# EAGLE board Proj_v27 (EAGLE 9.6.0)
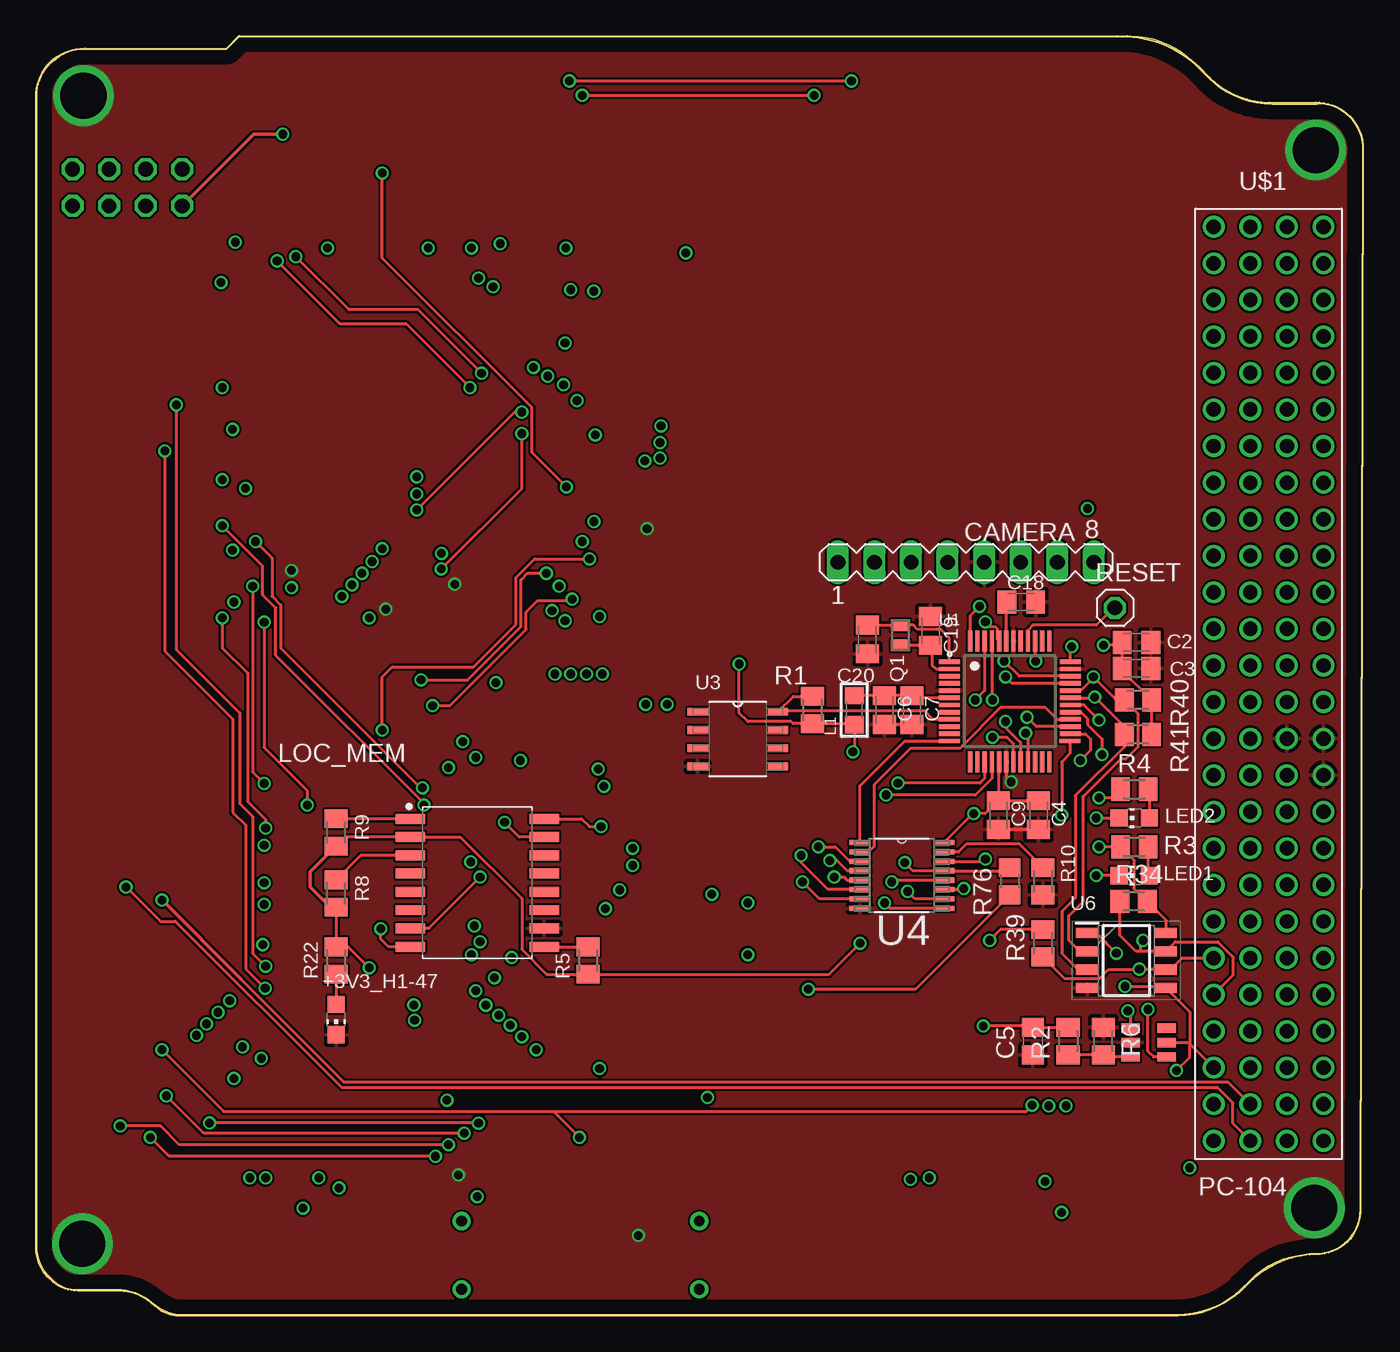
[diagram p7: board, top side]
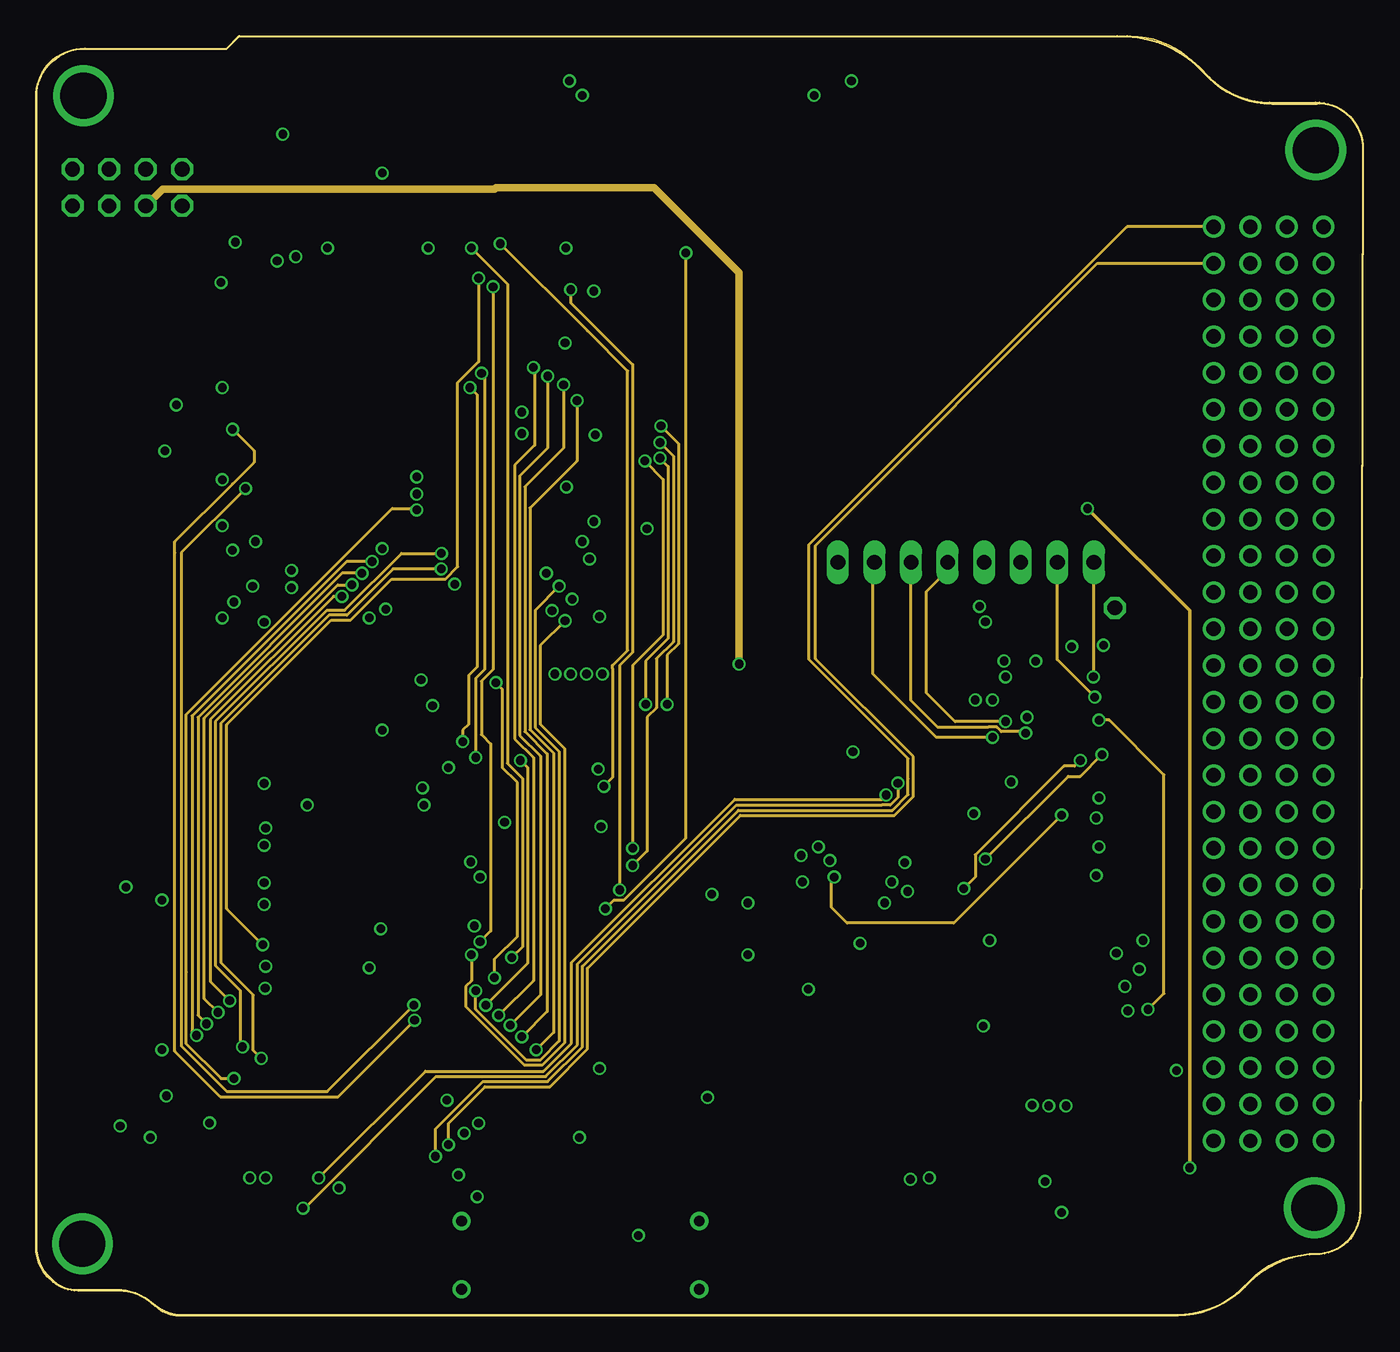
[diagram p8: board, inner layer Route]
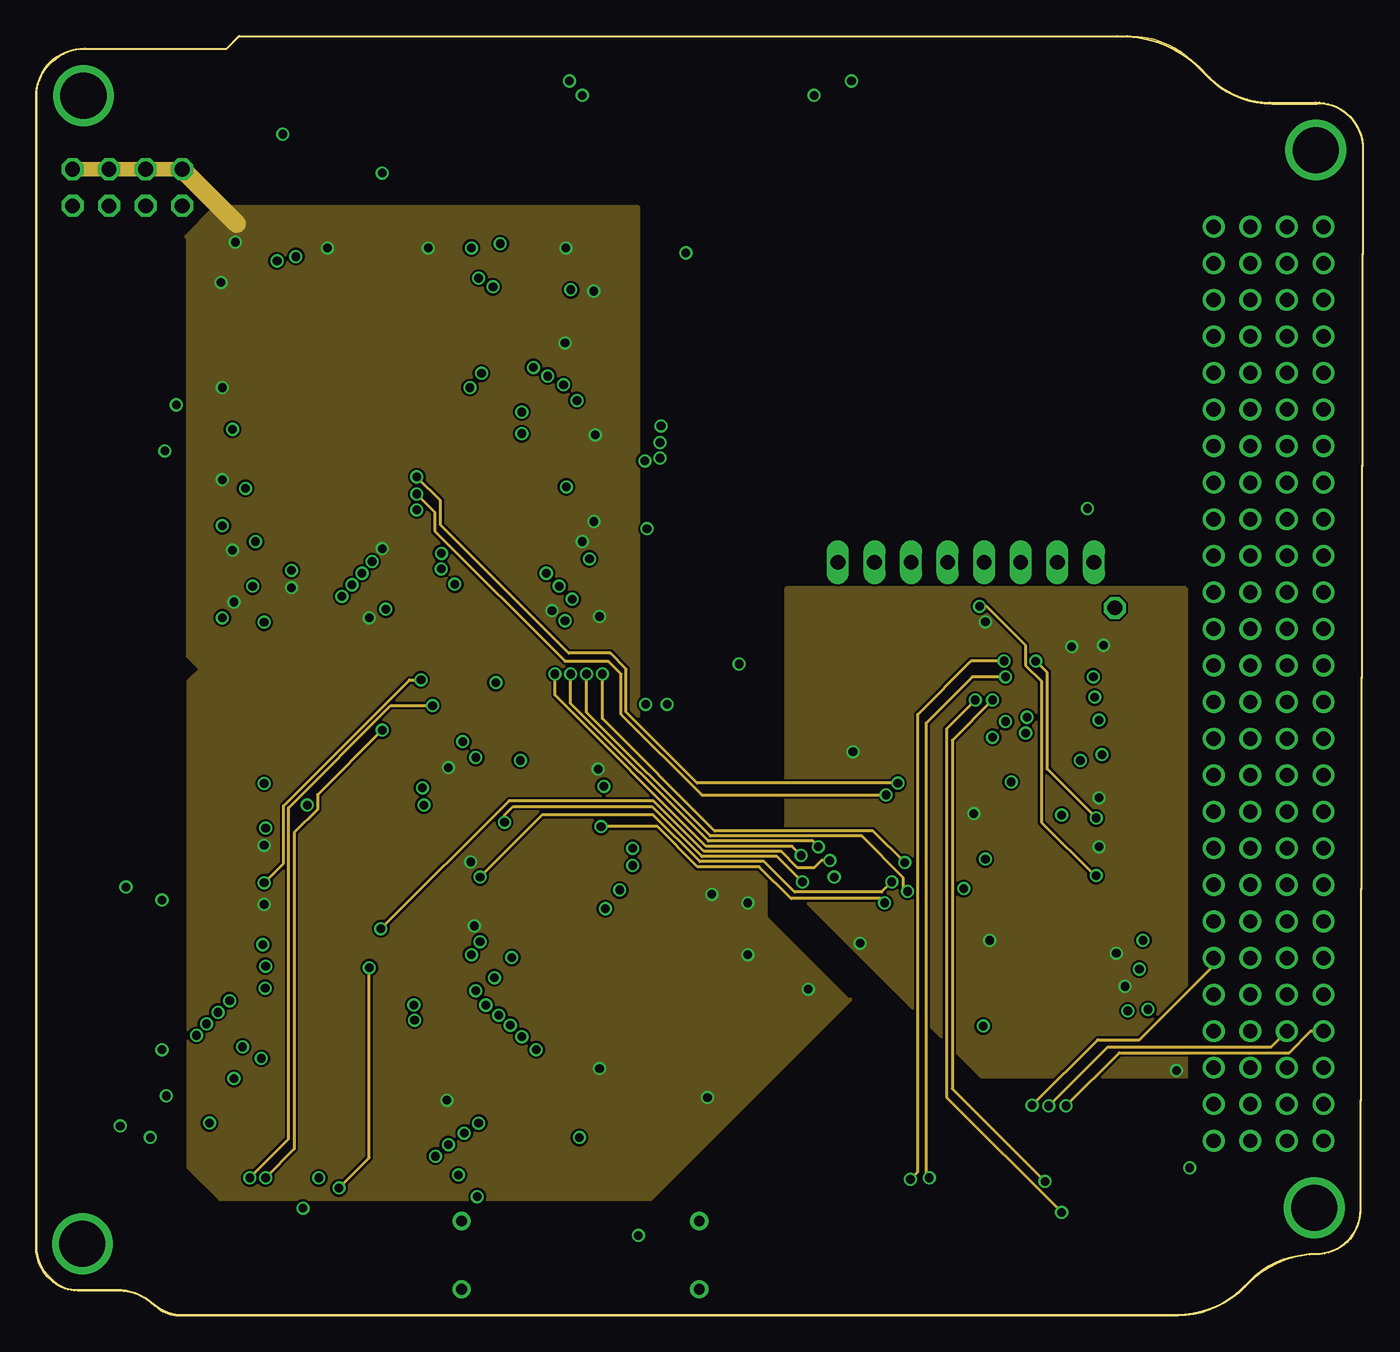
[diagram p9: board, inner layer Supply]
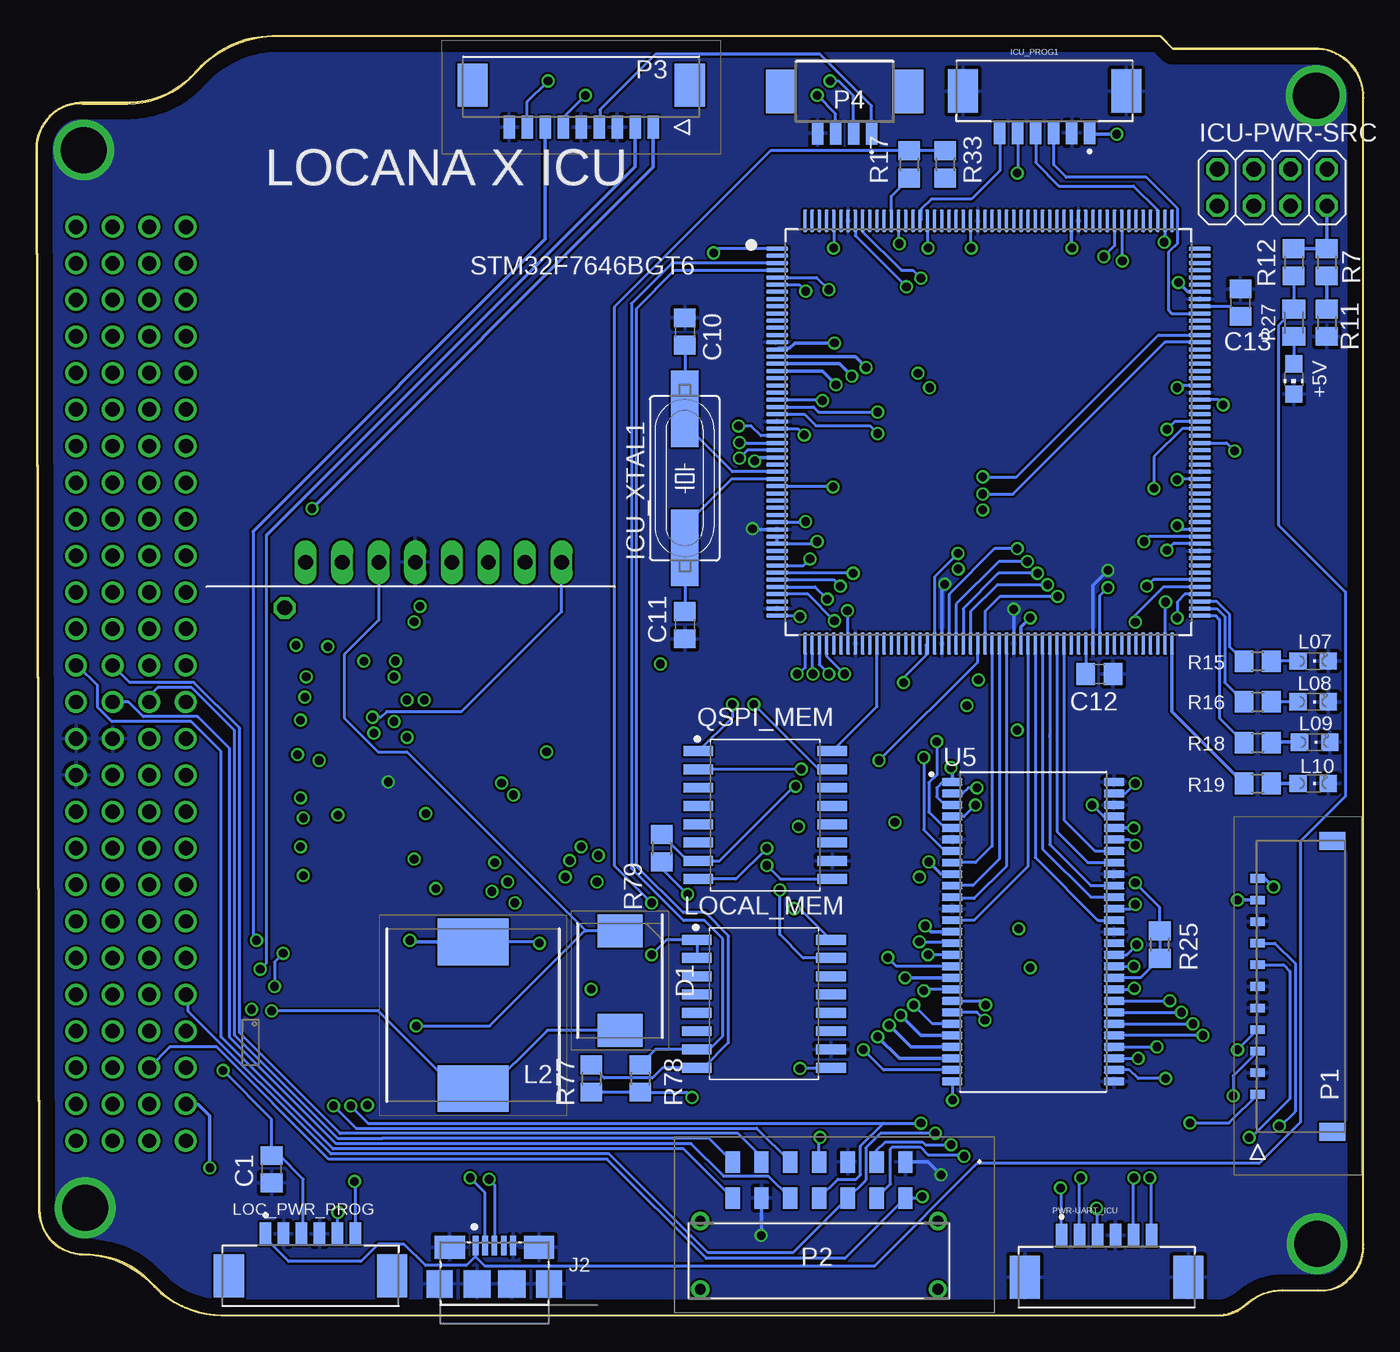
[diagram p10: board, bottom side, seen from below]

Size 92.22 x 88.9 mm. Coordinates in mm from the lower left corner, seen from the top.
Outline: 89.1,84.2 arc-90 92.22,81.05 92.02,7.52 arc-90 89,4.28 88.71,4.28 arc45 84.38,2.48 83.69,1.8 arc-45 79.36,0 9.88,0 arc-40 8.51,0.5 8.37,0.63 arc45 5.71,1.73 3.2,1.73 arc-90 0.05,4.83 0.05,84.83 arc-90 3.17,88 13.22,88 14.1,88.87 76.06,88.87 arc-45 80.39,87.08 81.5,85.97 arc45 85.84,84.18 89.02,84.18
Outline: 0,4.93 0,84.61 arc-90 3.41,88.03 13.25,88.03 14.12,88.9 75.11,88.9 arc-45 80.81,86.72 81.52,86.01 arc45 85.7,84.28 88.88,84.28 arc-90 92.17,81.13 92,7.66 arc-45 91.1,5.13 arc-35 89.21,4.28 89.05,4.28 arc45 84.27,2.3 83.98,2.01 arc-45 79.2,0.03 10.28,0.03 arc-41 8.04,0.87 arc41 5.62,1.78 3.15,1.78 arc-45 1.18,2.34 0.82,2.71 arc-45 0,4.93
Copper layers (1+2*15+16): Top 0.035mm / dielectric 1.5mm / Route 0.035mm / dielectric 0.15mm / Supply 0.035mm / dielectric 0.2mm / GND 0.035mm
Design rules "default *": minimum track width 6mil, minimum drill 0.6mm, track to track 6mil, track to pad 6mil, pad to pad 6mil, via to via 6mil, smd to smd 6mil, copper to edge 40mil, drill to drill 6mil, minimum pad ring 10mil, minimum via ring 6mil, stop-mask expansion 4mil, vias tented up to drill 0mil, thermal gap 10mil
Net classes: 0 default: width 0.203 mm; 1 GND: width 0.254 mm

## Footprints (pad centres in the part's own frame; a part is rotated, then mirrored left to right if it is on the bottom)
CHIP-LED0805 = smd 1.2 x 1.2: A 0,-1.05; C 0,1.05
C0805 = smd 1.3 x 1.5: 1 -0.95,0; 2 0.95,0
C0805K = smd 1.3 x 1.6: 1 -1,0; 2 1,0
MA08-1 = drill 1.016 long: 1 -8.89,0; 2 -6.35,0; 3 -3.81,0; 4 -1.27,0; 5 1.27,0; 6 3.81,0; 7 6.35,0; 8 8.89,0
DIOM7959X262N = smd 2.3 x 3.15: 1 -3.45,0; 2 3.45,0
2X04 = drill 1.016 octagon: 1 -3.81,-1.27; 2 -3.81,1.27; 3 -1.27,-1.27; 4 -1.27,1.27; 5 1.27,-1.27; 6 1.27,1.27; 7 3.81,-1.27; 8 3.81,1.27
MOLEX_0532610671 = smd 0.8 x 1.6: 1 -3.125,0; 2 -1.875,0; 3 -0.625,0; 4 0.625,0; 5 1.875,0; 6 3.125,0 | smd 2.1 x 3: S1 -5.675,-2.9; S2 5.675,-2.9
HC49UP = smd 5.334 x 1.93: 1 -4.826,0; 2 4.826,0
AMPHENOL_10118192-0001LF = smd 0.4 x 1.35: 1 -1.3,0; 2 -0.65,0; 3 0,0; 4 0.65,0; 5 1.3,0 | smd 2.1 x 1.6: SH1 -3.1,-0.125; SH2 3.1,-0.125 | smd 1.8 x 1.9: SH3 -3.8,-2.675; SH6 3.8,-2.675 | smd 1.9 x 1.9: SH4 -1.2,-2.675; SH5 1.2,-2.675
L0805 = smd 1.2 x 1.3: 1 -1.016,0; 2 1.016,0
INDPM120120X1000N = smd 3.25 x 4.95: 1 -5.1,0; 2 5.1,0
CHIPLED_0805 = smd 1.2 x 1.2: A 0,-1.05; C 0,1.05
SOIC127P1032X265-17T480X861N = smd 2.052 x 0.689: 1 -4.654,4.445; 2 -4.654,3.175; 3 -4.654,1.905; 4 -4.654,0.635; 5 -4.654,-0.635; 6 -4.654,-1.905; 7 -4.654,-3.175; 8 -4.654,-4.445; 9 4.654,4.445; 10 4.654,3.175; 11 4.654,1.905; 12 4.654,0.635; 13 4.654,-0.635; 14 4.654,-1.905; 15 4.654,-3.175; 16 4.654,-4.445
5040501191 = smd 0.6 x 1: 1 7.5,0; 2 6,0; 3 4.5,0; 4 3,0; 5 1.5,0; 6 0,0; 7 -1.5,0; 8 -3,0; 9 -4.5,0; 10 -6,0; 11 -7.5,0 | smd 1.25 x 1.8: 12 10.105,5.19; 13 -10.105,5.19
M806661442 = smd 1 x 1.5: 1 6,4.725; 2 6,2.225; 3 4,4.725; 4 4,2.225; 5 2,4.725; 6 2,2.225; 7 0,4.725; 8 0,2.225; 9 -2,4.725; 10 -2,2.225; 11 -4,4.725; 12 -4,2.225; 13 -6,4.725; 14 -6,2.225 | drill 0.75 pad 1.2: MH1 -8.25,-4.125; MH2 -8.25,0.625; MH3 8.25,-4.125; MH4 8.25,0.625
532610971 = smd 0.8 x 1.6: 1 -5,0; 2 -3.75,0; 3 -2.5,0; 4 -1.25,0; 5 0,0; 6 1.25,0; 7 2.5,0; 8 3.75,0; 9 5,0 | smd 2.1 x 3: 10 -7.55,-2.9; 11 7.55,-2.9
53261-0471 = smd 0.8 x 1.6: 1 -1.875,0.8; 2 -0.625,0.8; 3 0.625,0.8; 4 1.875,0.8 | smd 2.1 x 3: 5 4.425,-2.1; 6 -4.425,-2.1
XTAL_ECS-.327-12.5-12QS-TR = smd 0.8 x 1.3: 1 -0.7,0; 2 0.7,0
M0805 = smd 1.3 x 1.6: 1 -0.95,0; 2 0.95,0
R0805 = smd 1.3 x 1.5: 1 -0.95,0; 2 0.95,0
1X01 = drill 1.016 octagon: 1 0,0
QFP50P3000X3000X160-208N = smd 1.56 x 0.28: 1 -14.68,12.75; 2 -14.68,12.25; 3 -14.68,11.75; 4 -14.68,11.25; 5 -14.68,10.75; 6 -14.68,10.25; 7 -14.68,9.75; 8 -14.68,9.25; 9 -14.68,8.75; 10 -14.68,8.25; 11 -14.68,7.75; 12 -14.68,7.25; 13 -14.68,6.75; 14 -14.68,6.25; 15 -14.68,5.75; 16 -14.68,5.25; 17 -14.68,4.75; 18 -14.68,4.25; 19 -14.68,3.75; 20 -14.68,3.25; 21 -14.68,2.75; 22 -14.68,2.25; 23 -14.68,1.75; 24 -14.68,1.25; 25 -14.68,0.75; 26 -14.68,0.25; 27 -14.68,-0.25; 28 -14.68,-0.75; 29 -14.68,-1.25; 30 -14.68,-1.75; 31 -14.68,-2.25; 32 -14.68,-2.75; 33 -14.68,-3.25; 34 -14.68,-3.75; 35 -14.68,-4.25; 36 -14.68,-4.75; 37 -14.68,-5.25; 38 -14.68,-5.75; 39 -14.68,-6.25; 40 -14.68,-6.75; 41 -14.68,-7.25; 42 -14.68,-7.75; 43 -14.68,-8.25; 44 -14.68,-8.75; 45 -14.68,-9.25; 46 -14.68,-9.75; 47 -14.68,-10.25; 48 -14.68,-10.75; 49 -14.68,-11.25; 50 -14.68,-11.75; 51 -14.68,-12.25; 52 -14.68,-12.75; 105 14.68,-12.75; 106 14.68,-12.25; 107 14.68,-11.75; 108 14.68,-11.25; 109 14.68,-10.75; 110 14.68,-10.25; 111 14.68,-9.75; 112 14.68,-9.25; 113 14.68,-8.75; 114 14.68,-8.25; 115 14.68,-7.75; 116 14.68,-7.25; 117 14.68,-6.75; 118 14.68,-6.25; 119 14.68,-5.75; 120 14.68,-5.25; 121 14.68,-4.75; 122 14.68,-4.25; 123 14.68,-3.75; 124 14.68,-3.25; 125 14.68,-2.75; 126 14.68,-2.25; 127 14.68,-1.75; 128 14.68,-1.25; 129 14.68,-0.75; 130 14.68,-0.25; 131 14.68,0.25; 132 14.68,0.75; 133 14.68,1.25; 134 14.68,1.75; 135 14.68,2.25; 136 14.68,2.75; 137 14.68,3.25; 138 14.68,3.75; 139 14.68,4.25; 140 14.68,4.75; 141 14.68,5.25; 142 14.68,5.75; 143 14.68,6.25; 144 14.68,6.75; 145 14.68,7.25; 146 14.68,7.75; 147 14.68,8.25; 148 14.68,8.75; 149 14.68,9.25; 150 14.68,9.75; 151 14.68,10.25; 152 14.68,10.75; 153 14.68,11.25; 154 14.68,11.75; 155 14.68,12.25; 156 14.68,12.75 | smd 0.28 x 1.56: 53 -12.75,-14.68; 54 -12.25,-14.68; 55 -11.75,-14.68; 56 -11.25,-14.68; 57 -10.75,-14.68; 58 -10.25,-14.68; 59 -9.75,-14.68; 60 -9.25,-14.68; 61 -8.75,-14.68; 62 -8.25,-14.68; 63 -7.75,-14.68; 64 -7.25,-14.68; 65 -6.75,-14.68; 66 -6.25,-14.68; 67 -5.75,-14.68; 68 -5.25,-14.68; 69 -4.75,-14.68; 70 -4.25,-14.68; 71 -3.75,-14.68; 72 -3.25,-14.68; 73 -2.75,-14.68; 74 -2.25,-14.68; 75 -1.75,-14.68; 76 -1.25,-14.68; 77 -0.75,-14.68; 78 -0.25,-14.68; 79 0.25,-14.68; 80 0.75,-14.68; 81 1.25,-14.68; 82 1.75,-14.68; 83 2.25,-14.68; 84 2.75,-14.68; 85 3.25,-14.68; 86 3.75,-14.68; 87 4.25,-14.68; 88 4.75,-14.68; 89 5.25,-14.68; 90 5.75,-14.68; 91 6.25,-14.68; 92 6.75,-14.68; 93 7.25,-14.68; 94 7.75,-14.68; 95 8.25,-14.68; 96 8.75,-14.68; 97 9.25,-14.68; 98 9.75,-14.68; 99 10.25,-14.68; 100 10.75,-14.68; 101 11.25,-14.68; 102 11.75,-14.68; 103 12.25,-14.68; 104 12.75,-14.68; 157 12.75,14.68; 158 12.25,14.68; 159 11.75,14.68; 160 11.25,14.68; 161 10.75,14.68; 162 10.25,14.68; 163 9.75,14.68; 164 9.25,14.68; 165 8.75,14.68; 166 8.25,14.68; 167 7.75,14.68; 168 7.25,14.68; 169 6.75,14.68; 170 6.25,14.68; 171 5.75,14.68; 172 5.25,14.68; 173 4.75,14.68; 174 4.25,14.68; 175 3.75,14.68; 176 3.25,14.68; 177 2.75,14.68; 178 2.25,14.68; 179 1.75,14.68; 180 1.25,14.68; 181 0.75,14.68; 182 0.25,14.68; 183 -0.25,14.68; 184 -0.75,14.68; 185 -1.25,14.68; 186 -1.75,14.68; 187 -2.25,14.68; 188 -2.75,14.68; 189 -3.25,14.68; 190 -3.75,14.68; 191 -4.25,14.68; 192 -4.75,14.68; 193 -5.25,14.68; 194 -5.75,14.68; 195 -6.25,14.68; 196 -6.75,14.68; 197 -7.25,14.68; 198 -7.75,14.68; 199 -8.25,14.68; 200 -8.75,14.68; 201 -9.25,14.68; 202 -9.75,14.68; 203 -10.25,14.68; 204 -10.75,14.68; 205 -11.25,14.68; 206 -11.75,14.68; 207 -12.25,14.68; 208 -12.75,14.68
QFP50P900X900X120-48N = smd 1.45 x 0.3: 1 -4.2,2.75; 2 -4.2,2.25; 3 -4.2,1.75; 4 -4.2,1.25; 5 -4.2,0.75; 6 -4.2,0.25; 7 -4.2,-0.25; 8 -4.2,-0.75; 9 -4.2,-1.25; 10 -4.2,-1.75; 11 -4.2,-2.25; 12 -4.2,-2.75; 25 4.17,-2.75; 26 4.2,-2.25; 27 4.2,-1.75; 28 4.2,-1.25; 29 4.2,-0.75; 30 4.2,-0.25; 31 4.2,0.25; 32 4.2,0.75; 33 4.2,1.25; 34 4.2,1.75; 35 4.2,2.25; 36 4.2,2.75 | smd 0.3 x 1.45: 13 -2.75,-4.2; 14 -2.25,-4.2; 15 -1.75,-4.2; 16 -1.25,-4.2; 17 -0.75,-4.2; 18 -0.25,-4.2; 19 0.25,-4.2; 20 0.75,-4.2; 21 1.25,-4.2; 22 1.75,-4.2; 23 2.25,-4.2; 24 2.75,-4.2; 37 2.75,4.2; 38 2.25,4.2; 39 1.75,4.2; 40 1.25,4.2; 41 0.75,4.2; 42 0.25,4.2; 43 -0.25,4.2; 44 -0.75,4.2; 45 -1.25,4.2; 46 -1.75,4.2; 47 -2.25,4.2; 48 -2.75,4.2
SOIC127P600X175-8N = smd 1.422 x 0.533: 1 -2.794,1.905; 2 -2.794,0.635; 3 -2.794,-0.635; 4 -2.794,-1.905; 5 2.794,-1.905; 6 2.794,-0.635; 7 2.794,0.635; 8 2.794,1.905
SOP65P640X120-16N = smd 1.473 x 0.356: 1 -2.921,2.286; 2 -2.921,1.626; 3 -2.921,0.965; 4 -2.921,0.33; 5 -2.921,-0.33; 6 -2.921,-0.965; 7 -2.921,-1.626; 8 -2.921,-2.286; 9 2.921,-2.286; 10 2.921,-1.626; 11 2.921,-0.965; 12 2.921,-0.33; 13 2.921,0.33; 14 2.921,0.965; 15 2.921,1.626; 16 2.921,2.286
SOP80P1176X120-54N = smd 1.44 x 0.54: 1 -5.62,10.4; 2 -5.62,9.6; 3 -5.62,8.8; 4 -5.62,8; 5 -5.62,7.2; 6 -5.62,6.4; 7 -5.62,5.6; 8 -5.62,4.8; 9 -5.62,4; 10 -5.62,3.2; 11 -5.62,2.4; 12 -5.62,1.6; 13 -5.62,0.8; 14 -5.62,0; 15 -5.62,-0.8; 16 -5.62,-1.6; 17 -5.62,-2.4; 18 -5.62,-3.2; 19 -5.62,-4; 20 -5.62,-4.8; 21 -5.62,-5.6; 22 -5.62,-6.4; 23 -5.62,-7.2; 24 -5.62,-8; 25 -5.62,-8.8; 26 -5.62,-9.6; 27 -5.62,-10.4; 28 5.62,-10.4; 29 5.62,-9.6; 30 5.62,-8.8; 31 5.62,-8; 32 5.62,-7.2; 33 5.62,-6.4; 34 5.62,-5.6; 35 5.62,-4.8; 36 5.62,-4; 37 5.62,-3.2; 38 5.62,-2.4; 39 5.62,-1.6; 40 5.62,-0.8; 41 5.62,0; 42 5.62,0.8; 43 5.62,1.6; 44 5.62,2.4; 45 5.62,3.2; 46 5.62,4; 47 5.62,4.8; 48 5.62,5.6; 49 5.62,6.4; 50 5.62,7.2; 51 5.62,8; 52 5.62,8.8; 53 5.62,9.6; 54 5.62,10.4
SOIC127P600X175-8N' = smd 1.55 x 0.7: 1 -2.725,1.905; 2 -2.725,0.635; 3 -2.725,-0.635; 4 -2.725,-1.905; 5 2.725,-1.905; 6 2.725,-0.635; 7 2.725,0.635; 8 2.725,1.905
PC-104 = drill 1: P$1 -3.81,31.75; P$2 -1.27,31.75; P$3 -3.81,29.21; P$4 -1.27,29.21; P$5 -3.81,26.67; P$6 -1.27,26.67; P$7 -3.81,24.13; P$8 -1.27,24.13; P$9 -3.81,21.59; P$10 -1.27,21.59; P$11 -3.81,19.05; P$12 -1.27,19.05; P$13 -3.81,16.51; P$14 -1.27,16.51; P$15 -3.81,13.97; P$16 -1.27,13.97; P$17 -3.81,11.43; P$18 -1.27,11.43; P$19 -3.81,8.89; P$20 -1.27,8.89; P$21 -3.81,6.35; P$22 -1.27,6.35; P$23 -3.81,3.81; P$24 -1.27,3.81; P$25 -3.81,1.27; P$26 -1.27,1.27; P$27 -3.81,-1.27; P$28 -1.27,-1.27; P$29 -3.81,-3.81; P$30 -1.27,-3.81; P$31 -3.81,-6.35; P$32 -1.27,-6.35; P$33 -3.81,-8.89; P$34 -1.27,-8.89; P$35 -3.81,-11.43; P$36 -1.27,-11.43; P$37 -3.81,-13.97; P$38 -1.27,-13.97; P$39 -3.81,-16.51; P$40 -1.27,-16.51; P$41 -3.81,-19.05; P$42 -1.27,-19.05; P$43 -3.81,-21.59; P$44 -1.27,-21.59; P$45 -3.81,-24.13; P$46 -1.27,-24.13; P$47 -3.81,-26.67; P$48 -1.27,-26.67; P$49 -3.81,-29.21; P$50 -1.27,-29.21; P$51 -3.81,-31.75; P$52 -1.27,-31.75; P$53 1.27,31.75; P$54 3.81,31.75; P$55 1.27,29.21; P$56 3.81,29.21; P$57 1.27,26.67; P$58 3.81,26.67; P$59 1.27,24.13; P$60 3.81,24.13; P$61 1.27,21.59; P$62 3.81,21.59; P$63 1.27,19.05; P$64 3.81,19.05; P$65 1.27,16.51; P$66 3.81,16.51; P$67 1.27,13.97; P$68 3.81,13.97; P$69 1.27,11.43; P$70 3.81,11.43; P$71 1.27,8.89; P$72 3.81,8.89; P$73 1.27,6.35; P$74 3.81,6.35; P$75 1.27,3.81; P$76 3.81,3.81; P$77 1.27,1.27; P$78 3.81,1.27; P$79 1.27,-1.27; P$80 3.81,-1.27; P$81 1.27,-3.81; P$82 3.81,-3.81; P$83 1.27,-6.35; P$84 3.81,-6.35; P$85 1.27,-8.89; P$86 3.81,-8.89; P$87 1.27,-11.43; P$88 3.81,-11.43; P$89 1.27,-13.97; P$90 3.81,-13.97; P$91 1.27,-16.51; P$92 3.81,-16.51; P$93 1.27,-19.05; P$94 3.81,-19.05; P$95 1.27,-21.59; P$96 3.81,-21.59; P$97 1.27,-24.13; P$98 3.81,-24.13; P$99 1.27,-26.67; P$100 3.81,-26.67; P$101 1.27,-29.21; P$102 3.81,-29.21; P$103 1.27,-31.75; P$104 3.81,-31.75
SOT23-6 = smd 1.27 x 0.635: P$1 0,0; P$2 0,-1; P$3 0,-2; P$4 2.5,-2; P$5 2.5,-1; P$6 2.5,0

## Placement (x,y rotation side)
+3V3_H1-47  [CHIP-LED0805]  20.85,20.58 180 top
+5V  [CHIP-LED0805]  4.85,65.08 180 bottom
C1  22uF  [C0805]  75.85,10.18 90 bottom
C2  100nF  [C0805K]  76.45,46.78 0 top
C3  100nF  [C0805K]  76.45,44.98 0 top
C4  100nF  [C0805K]  69.65,34.78 270 top
C5  22uF  [C0805]  69.25,19.08 90 top
C6  100nF  [C0805K]  58.95,42.08 270 top
C7  10uF  [C0805K]  60.85,42.08 270 top
C9  10uF  [C0805K]  66.85,34.78 270 top
C10  2.2uF  [C0805]  47.15,68.38 270 bottom
C11  2.2uF  [C0805]  47.15,47.98 90 bottom
C12  2.2uF  [C0805]  18.35,44.58 180 bottom
C13  2.2uF  [C0805]  8.55,70.38 270 bottom
C18  1uF  [C0805K]  68.45,49.58 0 top
C19  22pF  [C0805K]  62.15,47.58 270 top
C20  22pF  [C0805K]  57.75,46.98 90 top
CAMERA  [MA08-1]  64.6,52.35 0 top
D1  SS34  [DIOM7959X262N]  51.65,23.28 270 bottom
ICU-PWR-SRC  [2X04]  6.35,78.38 0 bottom
ICU_PROG1  0532610671  [MOLEX_0532610671]  22.15,82.18 180 bottom
ICU_XTAL1  [HC49UP]  47.15,58.18 90 bottom
J2  10118192-0001LF  [AMPHENOL_10118192-0001LF]  60.38,4.88 0 bottom
L1  10uH  [L0805]  56.85,42.08 90 top
L2  SRR1210-220M  [INDPM120120X1000N]  61.85,20.88 90 bottom
L07  [CHIPLED_0805]  3.5,45.48 270 bottom
L08  [CHIPLED_0805]  3.5,42.65 270 bottom
L09  [CHIPLED_0805]  3.4,39.85 270 bottom
L10  [CHIPLED_0805]  3.5,36.98 270 bottom
LED1  [CHIP-LED0805]  76.3,30.58 90 top
LED2  [CHIP-LED0805]  76.3,34.58 90 top
LOC_MEM  SOIC127P600X175-16NSOIC-16YAS  [SOIC127P1032X265-17T480X861N]  30.65,30.08 0 top
LOC_PWR_PROG  0532610671  [MOLEX_0532610671]  73.15,5.68 0 bottom
LOCAL_MEM  SOIC127P600X175-16NSOIC-16YAS  [SOIC127P1032X265-17T480X861N]  41.65,21.68 0 bottom
P1  5040501191  [5040501191]  7.35,22.88 270 bottom
P2  M80-6661442  [M806661442]  37.83,5.95 0 bottom
P3  532610971  [532610971]  54.35,82.58 180 bottom
P4  53261-0471  [53261-0471]  36.05,82.95 180 bottom
PWR-UART_ICU  0532610671  [MOLEX_0532610671]  17.85,5.58 0 bottom
Q1  ECS-.327-12.5-12QS-TR  [XTAL_ECS-.327-12.5-12QS-TR]  60.05,47.28 90 top
QSPI_MEM  SOIC127P600X175-16NSOIC-16YAS  [SOIC127P1032X265-17T480X861N]  41.55,34.78 0 bottom
R1  1k  [M0805]  53.95,42.08 270 top
R2  2.2K  [M0805]  71.7,19.08 90 top
R3  220  [M0805]  76.3,32.58 180 top
R4  220  [M0805]  76.3,36.58 180 top
R5  10K  [M0805]  38.35,24.68 90 top
R6  300R  [M0805]  74.15,19.08 270 top
R7  10k  [R0805]  2.55,73.18 270 bottom
R8  10K  [M0805]  20.85,29.33 270 top
R9  10K  [M0805]  20.85,33.58 270 top
R10  10K  [M0805]  69.95,30.18 90 top
R11  10k  [R0805]  2.55,68.98 270 bottom
R12  10k  [R0805]  4.85,73.18 270 bottom
R15  10k  [R0805]  7.35,45.48 0 bottom
R16  10k  [R0805]  7.35,42.65 0 bottom
R17  10k  [R0805]  31.55,79.98 90 bottom
R18  10k  [R0805]  7.35,39.81 0 bottom
R19  10k  [R0805]  7.35,36.98 0 bottom
R22  220  [M0805]  20.85,24.68 90 top
R25  0  [R0805]  14.15,25.78 90 bottom
R27  220  [M0805]  4.85,68.98 90 bottom
R33  10k  [R0805]  29.05,79.98 90 bottom
R34  10K  [M0805]  76.25,28.78 0 top
R39  10K  [M0805]  69.95,25.88 90 top
R40  10K  [M0805]  76.55,42.78 0 top
R41  10K  [M0805]  76.55,40.38 0 top
R76  10K  [R0805]  67.65,30.18 270 top
R77  10K  [R0805]  53.65,16.48 270 bottom
R78  10K  [R0805]  50.25,16.48 270 bottom
R79  10K  [R0805]  48.75,32.48 270 bottom
RESET  [1X01]  74.95,49.18 0 top
STM32F7646BGT6  STM32F746BGT6  [QFP50P3000X3000X160-208N]  26.05,61.38 0 bottom
U1  ATSAMD21G18A-AF  [QFP50P900X900X120-48N]  67.65,42.68 0 top
U3  LM335D  [SOIC127P600X175-8N]  48.75,40.06 0 top
U4  SN74CB3Q3257PW  [SOP65P640X120-16N]  60.15,30.59 0 top
U5  AS4C32M16SB-7TCN  [SOP80P1176X120-54N]  22.95,26.68 0 bottom
U6  PCA9517AD  [SOIC127P600X175-8N']  75.75,24.68 0 top
U$1  PC-104  [PC-104]  85.62,43.9 0 top
U$2  MT3608SOT23-6  [SOT23-6]  76.05,19.98 0 top

## Tracks (layer width: path | path; a pad name or v marks a point on that pad's centre or on a via)
3.3
  GND 0.254: ICU-PWR-SRC.7 R7.1 R12.1
+3V3_H1-28
  GND 0.203: P2.13 45.46,12.31 68.16,12.31 68.17,12.3 71.23,12.3 78.43,19.49 78.43,40.67 81.4,43.64 83.78,43.64 84.36,43.07 U$1.P$28
+3V3_H1-47  (via drill 0.6)
  Top 0.203: U1.17 66.9,35.83 C9.1 65.95,34.88 v65.15,34.88 65.08,34.88 U4.16 | R9.2 21.48,33.25 LOC_MEM.2 29.47,33.25 33.75,28.98 33.75,25.46 35.48,23.73 R5.1 55.1,23.73 v57.25,25.88 | R8.2 20.85,28.18 R22.2 21.7,25.63 v23.15,24.18 | 80.15,18.9 U$1.P$47 | 80.15,18.9 80.15,21.1 U6.5 78.37,22.88 v75.65,22.88 | U$2.P$5 80.07,18.98 80.15,18.9 | v74.16,46.58 75.25,46.58 C2.1 C3.1 75.45,44.83 R40.2 R41.2 | U1.36 71.85,46.38 v71.95,46.48 | U1.44 66.8,46.97 66.8,47.71 66.66,47.86 66.3,47.86 v65.95,48.21 | R4.2 74.75,35.98 v73.85,35.98 | v56.75,39.18 56.85,39.28 L1.1 56.78,41.13 R1.2 52.6,41.13 52.45,41.28 49.45,41.28 48.85,41.88 v48.85,45.28 | R39.2 67,26.83 v66.25,26.08 | U6.1 73.64,26.58 v75.05,25.18 | R34.2 77.28,28.7 | 77.28,28.7 78.47,27.5 U6.8 | v73.85,32.58 R3.2 76.25,31.68 76.25,29.68 77.22,28.7 77.28,28.7 | v79.23,17.03 80.15,17.95 80.15,18.9
  Top 0.254: C9.1 C4.1 | R9.2 19.05,30.83 19.05,29.78 20.65,28.18 20.85,28.18
  Route 0.508: ICU-PWR-SRC.3 8.79,78.28 31.85,78.28 31.95,78.38 42.95,78.38 48.85,72.48 v48.85,45.28
  Supply 0.203: v21.05,8.88 23.15,10.98 v23.15,24.18
  GND 0.203: v57.25,25.88 57.35,25.98 L2.2 | v75.05,25.18 75.65,24.58 v75.65,22.88 | LOC_PWR_PROG.3 73.65,5.8 73.65,9.48 75.3,11.13 C1.2 75.85,13.65 v79.23,17.03 | PWR-UART_ICU.1 20.98,8.8 v21.05,8.88
  GND 0.254: L2.2 66.15,25.98 v66.25,26.08
  pour Supply: 52.05,50.48 52.05,30.18 65.65,16.58 79.95,16.58 79.95,50.48 79.85,50.58 52.15,50.58
+3V3_H1-49  (via drill 0.6)
  Route 0.254: v73.05,56.08 80.15,48.98 v80.15,10.28
  GND 0.254: P3.1 49.35,79.78 v73.05,56.08 | v80.15,10.28 80.15,13.88 80.97,14.69 U$1.P$49
+3V3_H2-27
  GND 0.203: U$1.P$79 85.78,42.63 84.77,41.63 81,41.63 78.78,39.41 78.78,19.35 71.38,11.95 68.03,11.95 68.01,11.96 46.71,11.96 44.43,9.67 41.32,9.67 P2.10
+5V
  GND 0.203: R12.2 R27.2 4.85,69.84 5.9,68.78 5.9,54.93 1.25,50.28 1.25,36.08 4.39,32.93 4.39,13.43 7.25,10.58 26.85,10.58 33.95,3.48 61.06,3.48 61.67,4.09 61.67,4.14 | LOC_PWR_PROG.1 76.28,5.37 74.68,3.78 69.65,3.78 68.45,4.98 66.65,4.98 65.17,3.5 62.32,3.5 61.67,4.14 | J2.1 61.67,4.14
+5V_CAM  (via drill 0.6)
  Top 0.203: R2.2 C5.2 69.15,20.13 v65.8,20.13
  GND 0.203: CAMERA.6 68.41,48.32 70.8,45.93 70.8,41.53 68.45,39.18 66.45,39.18 54,26.73 D1.1 54.1,26.73 60.7,20.13 v65.8,20.13
+5V_H1-48  (via drill 0.6)
  GND 0.203: v30.65,8.28 30.75,8.18 P2.2 36.02,3.98 45.65,3.98 52.55,10.88 71.87,10.88 79.66,18.67 82.92,18.67 U$1.P$48
+5V_H1-50  (via drill 0.6)
  Top 0.203: U$1.P$50 82.82,16.23 21.4,16.23 14.25,23.38
  Top 0.254: 14.25,23.38 v8.75,28.88
  GND 0.254: P1.10 v8.75,28.88
+5V_H1-52  (via drill 0.6)
  Top 0.203: v6.25,29.78 8.65,27.38 9.65,27.38 9.68,27.41 21.22,15.87 82.06,15.87 83.15,14.78 83.15,13.36 U$1.P$52
  GND 0.254: P1.11 6.85,30.38 v6.25,29.78
+5V_H2-25
  GND 0.203: P2.11 41.83,11.05 43.44,12.67 71.1,12.67 78.07,19.64 78.07,40.82 81.25,44 85.72,44 U$1.P$77
+5V_H2-26
  GND 0.203: P2.14 47.24,11.59 71.58,11.59 79.36,19.37 79.36,39.19 81.44,41.27 86.96,41.27 87.95,42.26 87.95,43.78 89.34,45.17 U$1.P$78
CAN_H_H1-3  (via drill 0.6)
  Top 0.203: v5.85,13.18 8.65,13.18 9.95,11.88 v28.65,11.88
  Route 0.203: v28.65,11.88 28.65,13.36 31.2,15.91 35.7,15.91 38.31,18.53 38.31,24.14 48.94,34.76 59.64,34.76 60.94,36.06 60.94,38.84 54.15,45.63 54.15,53.52 73.74,73.11 U$1.P$3
  GND 0.203: P1.8 6.15,25.88 4.75,24.48 4.75,14.18 5.75,13.18 v5.85,13.18 | P2.3 33.83,11.48 33.23,12.08 30.65,12.08 30.45,11.88 v28.65,11.88
CAN_L_H1-1  (via drill 0.6)
  Top 0.203: v27.75,11.08 9.25,11.08 v7.95,12.38
  Route 0.203: v27.75,11.08 27.75,12.97 31.05,16.27 35.55,16.27 37.96,18.68 37.96,24.28 48.79,35.12 59.49,35.12 60.59,36.21 60.59,37.3 60.58,37.31 60.58,38.71 53.71,45.58 53.71,53.58 75.78,75.65 U$1.P$1
  GND 0.203: P1.7 5.55,24.38 5.11,23.93 5.11,15.08 7.81,12.38 v7.95,12.38 | P2.4 32.85,9.15 32.85,11.58 32.71,11.72 30.8,11.72 30.25,11.17 27.84,11.17 v27.75,11.08
CLK  (via drill 0.6)
  Top 0.203: LOC_MEM.9 37.91,34.52 38.45,33.98 v39.25,33.98 | U4.9 59.33,28.3 v58.95,28.68
  Supply 0.203: v39.25,33.98 43.18,33.98 45.97,31.19 50.24,31.19 52.45,28.98 58.65,28.98 v58.95,28.68
CS  (via drill 0.6)
  Top 0.203: U4.12 59.57,30.26 v59.45,30.14 | v30.85,30.48 27.27,26.9 LOC_MEM.7
  Supply 0.203: v59.45,30.14 58.74,29.43 52.7,29.43 50.58,31.54 46.11,31.54 42.88,34.78 35.15,34.78 v30.85,30.48
D+  (via drill 0.6)
  Top 0.203: U1.34 68.3,44.43 v67.25,45.48
  Supply 0.203: v67.25,45.48 64.95,45.48 61.26,41.78 61.26,9.98 v60.75,9.48
  GND 0.203: v60.75,9.48 60.38,9.1 J2.3
D-  (via drill 0.6)
  Top 0.203: U1.33 67.8,43.93 v67.35,44.38
  Supply 0.203: v67.35,44.38 65.05,44.38 61.85,41.18 61.85,9.78 v62.05,9.58
  GND 0.203: v62.05,9.58 61.02,8.55 J2.2
EN_DCDC  (via drill 0.6)
  Top 0.203: U$2.P$4 77.65,17.98 77.25,18.38 v77.25,21.28 | v73.85,41.38 72.8,42.43 U1.30
  Route 0.203: v77.25,21.28 78.35,22.38 78.35,37.58 74.55,41.38 v73.85,41.38
FMC_A0  (via drill 0.6)
  Route 0.203: v32.15,20.88 34.55,23.28 34.55,38.78 33.25,40.08 33.25,59.08 34.65,60.48 34.65,65.78 v34.55,65.88
  GND 0.254: STM32F7646BGT6.16 35.3,66.63 v34.55,65.88 | v32.15,20.88 30.75,19.48 U5.23
FMC_A1  (via drill 0.6)
  Route 0.203: v35.55,65.28 35.55,60.28 33.61,58.33 33.61,40.32 35.05,38.88 35.05,22.28 v32.95,20.18
  GND 0.254: U5.24 31.45,18.68 v32.95,20.18 | v35.55,65.28 36.4,66.13 STM32F7646BGT6.17
FMC_A2  (via drill 0.6)
  Route 0.203: v36.65,64.68 36.65,60.28 33.96,57.59 33.96,40.58 35.51,39.03 35.51,21.13 v33.75,19.38
  GND 0.254: STM32F7646BGT6.18 37.6,65.63 v36.65,64.68 | v33.75,19.38 32.25,17.88 U5.25
FMC_A3  (via drill 0.6)
  Route 0.203: v37.58,63.58 37.58,59.38 34.32,56.11 34.32,40.73 35.96,39.09 35.96,19.69 v34.75,18.48
  GND 0.203: U5.26 33.35,17.08 v34.75,18.48 | STM32F7646BGT6.22 37.63,63.63
  GND 0.254: 37.63,63.63 v37.58,63.58
FMC_A4  (via drill 0.6)
  Top 0.203: v26.45,55.98 33.35,62.88 33.65,62.88 v33.75,62.78
  Route 0.203: v13.75,16.48 12.85,16.48 10.44,18.88 10.44,23.87 10.45,23.88 10.45,41.78 24.75,56.08 26.25,56.08 26.45,55.88 v26.45,55.98
  GND 0.203: v33.75,62.78 37.85,62.78 38.2,63.13 STM32F7646BGT6.23 | v13.75,16.48 15.65,16.48 16.25,17.08 U5.29
FMC_A5  (via drill 0.6)
  Top 0.203: v28.15,51.88 33.75,57.48 v33.75,61.28
  Route 0.203: v15.65,17.88 15.1,18.43 15.1,22.28 12.86,24.52 12.86,41.17 20.36,48.67 21.6,48.67 24.81,51.88 v28.15,51.88
  GND 0.203: U5.30 v15.65,17.88 | v33.75,61.28 34.3,61.83 38.05,61.83 38.85,62.63 STM32F7646BGT6.24
FMC_A6  (via drill 0.6)
  Route 0.203: v14.35,18.68 14.2,18.83 14.2,22.58 12.46,24.32 12.46,41.27 20.21,49.03 21.45,49.03 25.39,52.96 v28.17,52.96
  GND 0.203: U5.31 v14.35,18.68 | U5.31 17.65,18.68 17.85,18.48 17.53,18.48 U5.31 | v28.17,52.96 29.8,51.33 STM32F7646BGT6.71
FMC_A7  (via drill 0.6)
  Route 0.203: v11.15,19.48 10.85,19.78 10.85,41.67 21.57,52.39 v23.35,52.39
  GND 0.203: v11.15,19.48 U5.32 | v23.35,52.39 25.34,52.39 28.3,49.43 STM32F7646BGT6.74
FMC_A8  (via drill 0.6)
  Route 0.203: v11.85,20.28 11.25,20.88 11.25,41.57 21.26,51.58 v22.65,51.58
  GND 0.203: v22.65,51.58 25.35,51.58 27.8,49.13 STM32F7646BGT6.75 | U5.33 v11.85,20.28
FMC_A9  (via drill 0.6)
  Route 0.203: v12.65,21.08 11.7,22.03 11.7,41.52 20.96,50.78 v21.95,50.78
  GND 0.203: U5.34 v12.65,21.08 | v21.95,50.78 25.45,50.78 27.3,48.93 STM32F7646BGT6.76
FMC_A10  (via drill 0.6)
  Route 0.203: v33.65,38.58 34.15,38.08 34.15,24.48 v31.25,21.58
  GND 0.203: U5.22 29.95,20.28 v31.25,21.58 | v33.65,38.58 26.8,45.43 STM32F7646BGT6.77
FMC_A11  (via drill 0.6)
  Route 0.203: v13.45,21.88 12.1,23.23 12.1,41.42 20.66,49.98 v21.25,49.98
  GND 0.203: U5.35 v13.45,21.88 | v21.25,49.98 25.25,49.98 26.3,48.93 STM32F7646BGT6.78
FMC_A12  (via drill 0.6)
  Top 0.203: v8.95,60.08 8.95,46.18 13.67,41.46 13.67,34.98 14.57,34.08 14.57,24.1 v15.92,22.75
  GND 0.203: STM32F7646BGT6.129 9.5,60.63 v8.95,60.08 | U5.36 16,22.68 v15.92,22.75
FMC_A14  (via drill 0.6)
  Route 0.203: v26.25,21.58 20.24,15.57 13.25,15.57 10.09,18.74 10.09,53.02 v14.55,57.48
  GND 0.203: U5.20 26.65,21.88 26.35,21.58 v26.25,21.58 | STM32F7646BGT6.131 12.6,61.63 14.55,59.68 v14.55,57.48
FMC_A15  (via drill 0.6)
  Route 0.203: v26.3,20.53 20.99,15.22 12.81,15.22 9.65,18.38 9.65,52.98 9.65,53.78 13.66,57.79 15.14,59.28 15.14,60.08 v13.65,61.58
  GND 0.203: v13.65,61.58 13.1,62.13 STM32F7646BGT6.132 | v26.3,20.53 26.86,21.08 U5.21
FMC_DQ0  (via drill 0.6)
  Top 0.203: v15.25,53.78 16.4,52.63 16.4,49.99 17.01,49.38 17.01,46.38 26.71,36.68 v26.85,36.68
  GND 0.203: v15.25,53.78 14.9,54.13 STM32F7646BGT6.116 | v26.85,36.68 27.45,36.68 27.85,36.28 U5.2
FMC_DQ1  (via drill 0.6)
  Top 0.203: v26.95,35.48 26.95,35.58 16.66,45.87 16.66,49.18 15.76,50.08 15.76,52.07 v12.95,54.88
  GND 0.203: STM32F7646BGT6.117 12.8,54.63 13,54.83 v12.95,54.88 | v26.95,35.48 27.75,34.68 U5.4
FMC_DQ2  (via drill 0.6)
  Top 0.203: v16.75,73.28 21.1,68.93 25.7,68.93 v30.15,64.48
  Route 0.203: v30.15,64.48 30.65,63.98 30.65,45.08 30.06,44.48 30.06,41.08 29.65,40.68 v29.65,39.88
  GND 0.203: STM32F7646BGT6.164 16.8,73.33 v16.75,73.28 | U5.5 29.08,33.88 30.19,34.99 30.19,37.03 29.65,37.58 v29.65,39.88
FMC_DQ3  (via drill 0.6)
  Top 0.203: v18.05,73.58 21.75,69.88 26.55,69.88 v30.95,65.48
  Route 0.203: v30.95,65.48 31.15,65.28 31.15,44.88 30.55,44.28 v30.55,38.78
  GND 0.203: STM32F7646BGT6.165 17.3,74.33 v18.05,73.58 | v30.55,38.78 30.55,33.75 29.08,32.28 U5.7
FMC_DQ4
  GND 0.203: STM32F7646BGT6.79 25.8,32.63 26.95,31.48 U5.8
FMC_DQ5
  GND 0.203: STM32F7646BGT6.80 25.3,31.73 27.15,29.88 U5.10
FMC_DQ6
  GND 0.203: STM32F7646BGT6.81 24.8,31.23 27.05,28.98 28.47,28.98 U5.11
FMC_DQ7
  GND 0.203: STM32F7646BGT6.84 23.3,31.23 27.05,27.48 U5.13
FMC_DQ8
  GND 0.203: STM32F7646BGT6.85 22.8,31.83 18.45,27.48 U5.42
FMC_DQ9
  GND 0.203: STM32F7646BGT6.86 22.3,41.68 22.3,41.43 22.3,32.43 18.95,29.08 U5.44
FMC_DQ10
  GND 0.203: STM32F7646BGT6.87 21.8,40.38 21.8,40.23 21.8,32.73 18.95,29.88 U5.45
FMC_DQ11
  GND 0.203: U5.47 19.15,31.48 21.3,33.63 STM32F7646BGT6.88
FMC_DQ12
  GND 0.203: U5.48 18.65,32.28 20.8,34.43 STM32F7646BGT6.89
FMC_DQ13  (via drill 0.6)
  Top 0.203: v15.95,33.88 15.95,34.48 14.69,35.74 14.69,44.63 12.95,46.38 v12.95,48.48
  GND 0.203: v12.95,48.48 12.95,49.58 12.4,50.13 STM32F7646BGT6.108
  GND 0.254: v15.95,33.88 U5.50
FMC_DQ14  (via drill 0.6)
  Top 0.203: v15.85,48.18 15.85,39.48 18.85,36.48 v18.85,35.48
  GND 0.203: v15.85,48.18 15.85,48.68 13.9,50.63 STM32F7646BGT6.109 | v18.85,35.48 18.05,34.68 U5.51
FMC_DQ15  (via drill 0.6)
  Top 0.203: v15.05,50.68 15.05,37.78 v15.85,36.98
  GND 0.203: STM32F7646BGT6.110 14.6,51.13 v15.05,50.68 | v15.85,36.98 16.55,36.28 U5.53
FMC_NBL0  (via drill 0.6)
  Route 0.203: v30.75,72.08 30.75,66.28 29.3,64.83 29.3,52.03 28.44,51.17 24.71,51.17 21.85,48.31 20.51,48.31 13.26,41.07 13.26,28.27 v15.76,25.78
  GND 0.203: v30.75,72.08 31.3,72.63 32.11,72.63 34.8,75.32 STM32F7646BGT6.200 | U5.39 16.46,25.08 v15.76,25.78
FMC_NBL1  (via drill 0.6)
  Route 0.203: v31.75,71.48 31.75,44.88 30.95,44.08 30.95,40.38 31.59,39.74 31.59,26.72 v30.85,25.98
  GND 0.203: U5.15 28.67,25.98 v30.85,25.98 | STM32F7646BGT6.201 35.3,75.03 v31.75,71.48
FMC_SDCKE0  (via drill 0.6)
  Top 0.203: v35.45,51.58 34.15,51.58 33.69,51.12 33.69,47.88 29.99,44.18 v26.75,44.18
  Supply 0.203: v15.85,30.08 17.19,31.42 17.19,35.43 25.95,44.18 v26.75,44.18
  GND 0.203: U5.37 15.5,23.48 R25.1 R25.2 14.15,28.38 v15.85,30.08 | STM32F7646BGT6.46 35.5,51.63 v35.45,51.58
FMC_SDCLK  (via drill 0.6)
  Top 0.203: v15.95,24.28 15.05,25.18 15.05,34.68 14.15,35.58 14.15,41.88 9.75,46.28 v9.75,63.28
  GND 0.203: U5.38 v15.95,24.28 | v9.75,63.28 10.1,63.63 STM32F7646BGT6.135
FMC_SDNCAS  (via drill 0.6)
  Route 0.203: v30.25,74.18 32.75,71.68 32.75,38.38 33.79,37.33 33.79,25.62 v33.05,24.88
  GND 0.203: STM32F7646BGT6.191 30.3,74.23 v30.25,74.18 | U5.17 32.45,24.28 v33.05,24.88
FMC_SDNE0  (via drill 0.6)
  Route 0.203: v30.55,22.58 v30.54,22.57 30.54,21.29 34.06,17.77 35.04,17.77 36.35,19.08 36.35,39.2 34.67,40.87 34.67,49 v36.35,50.68
  GND 0.203: STM32F7646BGT6.47 36.8,51.13 v36.35,50.68 | U5.19 30.45,22.68 v30.55,22.58
FMC_SDNRAS  (via drill 0.6)
  Route 0.203: v31.95,43.98 32.39,43.53 32.39,38.08 33.44,37.03 33.44,26.37 31.85,24.78 v31.85,23.48
  GND 0.203: STM32F7646BGT6.70 30.41,46.59 30.41,45.85 31.95,44.31 v31.95,43.98
  GND 0.254: U5.18 v31.85,23.48
FMC_SDNWE  (via drill 0.6)
  Route 0.203: v36.75,48.28 35.03,46.56 35.03,41.1 36.75,39.38 36.75,23.58 36.75,18.98 35.19,17.42 33.91,17.42 29.84,21.48 29.84,22.87 30.25,23.28 v30.25,25.08
  GND 0.203: v36.75,48.28 38.6,50.13 STM32F7646BGT6.49 | U5.16 v30.25,25.08
GND  (via drill 0.6, 3.2)
  Top 0.254: U1.18 67.4,37.43 v67.75,37.08 | C9.2 C4.2 | C6.2 C7.2
  GND 0.254: P2.1 30.25,10.68 v29.35,9.78 | P2.12 41.83,5.6 v41.85,5.58 | STM32F7646BGT6.93 18.8,50.73 v17.75,51.78 | STM32F7646BGT6.72 29.3,50.62 v29.09,50.82 | STM32F7646BGT6.40 42.4,54.63 v42.45,54.68 | v24.29,49.08 24.29,47.47 24.3,47.47 STM32F7646BGT6.82
  other vias: 88.9,80.98 3.22,5 3.3,84.75 88.8,7.5
  pour Top: 3.08,-0.35 92.57,-0.35 92.57,85.55 88.92,89.2 2.16,89.2 0.99,88.81 -1.87,85.95 -1.87,4.61
  pour GND: 3.58,-2.45 90.12,-2.45 94.77,2.21 94.77,83.55 88.62,89.7 1.87,89.7 -0.1,88.72 -2.57,86.25 -2.57,3.71
I2C_2_SCL(B)_P4  (via drill 0.6)
  Top 0.203: v56.65,85.78 v37.05,85.78
  GND 0.203: P4.2 35.42,84.75 36.46,85.78 v37.05,85.78 | P3.8 58.1,84.33 v56.65,85.78
I2C_2_SDA(B)_P4
  GND 0.203: P4.1 34.17,84.05 37.75,87.63 49.2,87.63 53.05,83.78 53.05,82.08
  GND 0.254: 53.05,82.08 53.1,82.13 P3.4
I2C_SCL_H1-43  (via drill 0.6)
  Top 0.203: v9.05,15.28 11.66,12.68 v29.75,12.68 | U$1.P$43 83.15,23.65 83.15,24.94 82.12,25.98 79.14,25.98 U6.7 76.75,25.31 | 76.75,25.31 76.42,25.31 75.3,26.43 R34.1 | 76.75,25.31 76.75,25.92 v76.91,26.08
  GND 0.203: P1.3 9.05,16.68 v9.05,15.28 | v29.75,12.68 30.45,12.68 30.46,12.67 33.56,12.67 34.58,11.65 34.58,9.42 P2.6 39.62,4.38 45.55,4.38 52.4,11.23 71.73,11.23 81.65,21.16 81.65,22.31 U$1.P$43 | v76.91,26.08 77.15,26.32 77.15,54.48
  GND 0.254: 77.15,54.48 56.85,74.78 P3.7
I2C_SDA_H1-41  (via drill 0.6)
  Top 0.203: 76.69,24.04 U6.6 78.84,24.04 79.65,24.85 U$1.P$41 | 76.69,24.04 v76.65,24.08 | v37.75,12.38 35.94,14.19 | v8.75,18.48 13.04,14.19 35.94,14.19 | 76.69,24.04 74.51,24.04 73.91,23.44 71.44,23.44 R39.1 | 35.94,14.19 68.74,14.19 68.75,14.18 v69.2,14.63
  Supply 0.203: v69.2,14.63 73.75,19.18 76.65,19.18 81.81,24.34 U$1.P$41
  GND 0.203: P2.7 37.83,12.38 v37.75,12.38 | P1.4 v8.75,18.48 | v76.65,24.08 76.2,24.53 76.2,54.23
  GND 0.254: P3.2 50.6,79.83 76.2,54.23
ICU_SDA
  GND 0.203: STM32F7646BGT6.196 32.8,77.78 R17.1
L06
  GND 0.254: L09.A 6.37,39.85 R18.2
L07
  GND 0.254: L10.A R19.2
L08
  GND 0.203: L07.A R15.2
L09
  GND 0.203: L08.A R16.2
MISO  (via drill 0.6)
  Top 0.203: v23.95,26.88 23.95,26.18 24.49,25.63 LOC_MEM.8 | U4.4 56.35,30.92 55.65,31.62 v55.15,31.62
  Supply 0.203: v23.95,26.88 32.85,35.78 42.89,35.78 46.41,32.26 51.77,32.26 52.91,31.12 54.05,31.12 54.55,31.62 v55.15,31.62
MISO_ICU  (via drill 0.6)
  Top 0.203: U4.3 56.55,31.55 55.52,32.58 v54.35,32.58
  Supply 0.203: v54.35,32.58 53.96,32.97 46.7,32.97 37.15,42.52 v37.15,44.58
  GND 0.203: STM32F7646BGT6.55 37.8,45.23 v37.15,44.58
MISO_LOC  (via drill 0.6)
  Top 0.203: v68.75,40.48 68.9,40.33 U1.21
  Route 0.203: v68.75,40.48 68.66,40.57 67.06,40.57 66.74,40.88 66.16,40.88 66.15,40.88 62.65,40.88 60.79,42.74 CAMERA.3
MISOLOC_MEM
  Top 0.203: U1.28 70.95,41.43 70.09,42.28 67.04,42.28 64.18,39.42 60.76,39.42 58.22,36.88 58.22,32.59 57.84,32.21 U4.2
MOSI  (via drill 0.6)
  Top 0.203: LOC_MEM.10 33.58,33.25 v32.55,34.28 | U4.7 54.42,28.96 v53.25,30.13
  Supply 0.203: v32.55,34.28 32.55,34.78 33.15,35.38 42.78,35.38 46.26,31.9 51.48,31.9 v53.25,30.13
MOSI_ICU  (via drill 0.6)
  Top 0.203: U4.6 55.01,29.62 53.15,31.48 v53.15,31.98
  Supply 0.203: v53.15,31.98 52.52,32.61 46.55,32.61 36.05,43.12 v36.05,44.58
  GND 0.203: STM32F7646BGT6.56 37.3,45.83 v36.05,44.58
MOSI_LOC  (via drill 0.6)
  Top 0.203: U1.19 67.9,39.73 67.45,40.18 v66.45,40.18
  Route 0.203: CAMERA.2 58.25,51.48 58.15,51.38 58.15,44.58 62.55,40.18 v66.45,40.18
MOSILOC_MEM  (via drill 0.6)
  Top 0.203: U1.25 71.82,39.05 71.25,38.48 v71.25,34.78 | v55.45,30.48 56.15,30.48 56.37,30.26 U4.5
  Route 0.203: v71.25,34.78 63.75,27.28 56.35,27.28 55.25,28.38 55.25,30.28 v55.45,30.48
N$1
  Top 0.203: C20.2 59.75,47.98 Q1.2 60.94,47.98 61.24,47.67 62.86,47.67 63.45,47.09 U1.1
N$2
  Top 0.203: LOC_MEM.16 R5.2
N$3
  Top 0.203: LOC_MEM.1 R9.1
N$4
  Top 0.203: LOC_MEM.3 22.55,31.98 R8.1
N$5
  GND 0.254: STM32F7646BGT6.104 13.3,41.98 R19.1
N$6
  Top 0.203: U1.6 61,42.93 C7.1 C6.1 56.87,43.08 L1.2
N$7  (via drill 0.6)
  Top 0.203: U$2.P$1 76.05,20.98 v75.85,21.18
  GND 0.203: L2.1 61.3,15.23 | v75.85,21.18 68.45,21.18 61.9,14.63 61.3,15.23 | D1.2 56.7,19.83 61.3,15.23
N$8
  GND 0.203: R15.1 9.29,46.47 9.29,48.73 10.2,49.63 STM32F7646BGT6.107
N$9
  Top 0.203: R3.1 77.25,30.68 LED1.A
N$10
  Top 0.203: U1.43 67.4,49.53 C18.1
N$11
  Top 0.203: Q1.1 C19.2 62.25,46.48 62.25,45.18 62.5,44.93 U1.2
N$12
  Top 0.203: R4.1 77.35,36.48 LED2.A
N$13
  Top 0.203: U$2.P$3 74.3,17.98 R6.2 R2.1
N$14
  Top 0.203: R22.1 +3V3_H1-47.A
N$15
  GND 0.254: R7.2 R11.1
N$17
  GND 0.203: STM32F7646BGT6.106 10.2,49.13 9.65,48.58 9.65,44 R16.1
N$18
  GND 0.203: STM32F7646BGT6.105 10.26,48.63 10.01,48.38 10.01,41.52 R18.1
N$19
  GND 0.203: STM32F7646BGT6.32 43.85,58.63 47.15,61.93 ICU_XTAL1.2 C10.2
N$22
  GND 0.203: STM32F7646BGT6.92 C12.2
N$23
  GND 0.203: R27.1 +5V.A
N$24
  GND 0.203: STM32F7646BGT6.148 9.25,70.13 C13.2
N$31
  Top 0.203: R10.2 68.3,32.78 64.65,32.78 64.08,32.21 U4.15
NRST  (via drill 0.6)
  Top 0.203: v24.05,79.38 24.05,73.48 34.46,63.07 34.46,59.97 v36.85,57.58
  GND 0.203: STM32F7646BGT6.34 36.9,57.63 v36.85,57.58 | ICU_PROG1.5 24.02,79.4 v24.05,79.38
PROG_3V3  (via drill 0.6)
  Top 0.254: ICU-PWR-SRC.1 15.13,82.08 v17.15,82.08
  GND 0.254: v17.15,82.08 18.93,82.08 ICU_PROG1.1
QSPI_CLK
  GND 0.203: QSPI_MEM.9 33.8,42.32 STM32F7646BGT6.63
QSPI_IO0  (via drill 0.6)
  Route 0.203: v42.35,42.48 42.35,45.48 43.92,47.05 43.92,59.01 v43.35,59.58
  GND 0.203: STM32F7646BGT6.29 42.8,60.13 v43.35,59.58 | v42.35,42.48 37.83,37.95 QSPI_MEM.10
QSPI_IO1  (via drill 0.6)
  Route 0.203: v41.45,32.48 41.45,45.18 43.57,47.3 43.57,58.1 v42.29,59.38
  GND 0.203: v41.45,32.48 43.59,30.33 QSPI_MEM.8
  GND 0.254: STM32F7646BGT6.30 42.04,59.63 v42.29,59.38
QSPI_IO2  (via drill 0.6)
  Route 0.203: v41.45,31.28 42.45,32.28 42.45,41.58 43.1,42.23 43.1,45.64 44.28,46.82 44.28,59.73 v43.35,60.65
  GND 0.203: v43.35,60.65 43.33,60.63 STM32F7646BGT6.28 | QSPI_MEM.16 40.5,30.33 v41.45,31.28
QSPI_IO3  (via drill 0.6)
  Route 0.203: v43.42,61.81 44.63,60.59 44.63,46.67 43.85,45.89 v43.85,42.48
  GND 0.203: QSPI_MEM.1 43.85,41.58 v43.85,42.48 | v43.42,61.81 42.55,61.81 41.87,61.13 STM32F7646BGT6.27
QSPI_NCS  (via drill 0.6)
  Route 0.203: v32.25,74.48 38.3,68.43 41.09,65.63 41.09,46.23 40.05,45.18 40.05,44.98 40.05,37.38 v39.45,36.78
  GND 0.203: STM32F7646BGT6.195 32.3,74.53 v32.25,74.48 | v39.45,36.78 39.55,36.78 44.73,31.6 QSPI_MEM.7 46.92,31.6 R79.1
RESET_LOC
  Top 0.203: RESET.1 74.85,49.18 73.65,47.98 69.27,47.98 68.9,47.61 U1.40
RX1  (via drill 0.6)
  Top 0.203: U1.15 65.9,37.33 65.57,37.01 v59.88,37.01
  Route 0.203: v18.55,7.48 18.65,7.48 27.79,16.62 35.4,16.62 37.6,18.82 37.6,24.43 48.65,35.48 58.75,35.48 58.76,35.47 59.34,35.47 59.88,36.01 v59.88,37.01
  Supply 0.203: v59.88,37.01 45.93,37.01 41.01,41.93 41.01,44.92 39.9,46.03 37,46.03 28.1,54.93 28.1,56.63 v26.45,58.28
  GND 0.203: STM32F7646BGT6.144 14.25,68.13 24.1,58.28 v26.45,58.28 | PWR-UART_ICU.3 18.48,7.4 v18.55,7.48
RX2  (via drill 0.6)
  Top 0.203: v37.25,49.78 37.16,49.68 34.86,49.68 34.05,48.88 34.05,47.68 28.75,42.38 v27.55,42.38
  Supply 0.203: v14.85,9.58 17.55,12.28 17.55,35.28 24.65,42.38 v27.55,42.38
  GND 0.203: PWR-UART_ICU.6 14.72,9.45 v14.85,9.58 | STM32F7646BGT6.48 38.1,50.63 v37.25,49.78
RX_LED  (via drill 0.6)
  Top 0.203: U1.48 64.9,48.63 v65.55,49.28 | LED1.C v73.65,30.58
  Supply 0.203: v65.55,49.28 66.05,49.28 68.74,46.58 68.74,45.19 69.85,44.08 69.85,34.28 73.55,30.58 v73.65,30.58
SCK_ICU  (via drill 0.6)
  Top 0.203: U4.10 61.07,28.96 v60.55,29.48
  Supply 0.203: v60.55,29.48 60.26,29.77 60.26,30.43 57.36,33.32 46.85,33.32 38.25,41.92 v38.25,44.58
  GND 0.203: STM32F7646BGT6.54 38.3,44.63 v38.25,44.58
SCK_LOC  (via drill 0.6)
  Top 0.203: v67.35,41.28 67.35,40.88 68.4,39.83 U1.20
  Route 0.203: CAMERA.4 63.33,51.78 61.85,50.3 61.85,43.28 63.85,41.28 v67.35,41.28
SCKLOC_MEM  (via drill 0.6)
  Top 0.203: U1.26 72.9,40.43 73.25,40.08 73.25,39.28 v72.55,38.58
  Top 0.254: U4.11 64.39,29.62 v64.45,29.68
  Route 0.203: v64.45,29.68 65.24,30.47 65.24,32.02 71.41,38.18 72.15,38.18 v72.55,38.58
SCL0_LOC  (via drill 0.6)
  Top 0.203: U6.2 72.52,25.31 71.75,26.08 71.75,27.78 72.75,28.78 72.75,36.08 75.35,38.68 75.71,38.68 76.55,39.52 76.55,41.83 R40.1 75.05,42.78 v73.45,44.38 73.45,44.29 72.58,43.43 U1.32
  Route 0.203: CAMERA.8 73.45,52.31 v73.45,44.38
SDA0_LOC  (via drill 0.6)
  Top 0.203: U6.3 72.38,24.04 71.25,25.18 71.25,28.08 72.2,29.03 72.2,36.13 75.6,39.53 R41.1 75.6,40.93 v73.55,42.98 73.5,42.93 U1.31
  Route 0.203: v73.55,42.98 70.95,45.58 CAMERA.7
SELECTOR
  Top 0.203: U4.1 57.23,36.81 60.35,39.93 U1.12
SPI4_CLK  (via drill 0.6)
  Route 0.203: v39.55,28.28 40.14,28.87 40.84,28.87 45.15,33.18 v45.15,73.83
  GND 0.203: LOCAL_MEM.9 39.15,28.28 v39.55,28.28 | STM32F7646BGT6.1 44.86,74.13 v45.15,73.83
SPI4_CS
  GND 0.203: STM32F7646BGT6.3 48.05,73.13 50.85,70.32 50.85,31.08 47.22,27.45 45.78,27.45 44.5,26.18 44.5,19.45 45.45,18.5 LOCAL_MEM.7 49.17,18.5 R78.1
SPI4_MISO
  GND 0.203: R77.1 52.75,16.52 49.4,16.52 48.69,17.23 LOCAL_MEM.8 45.84,17.23 44.1,18.98 44.1,26.38 45.73,28 47.27,28 50.5,31.23 50.5,69.98 47.85,72.63 STM32F7646BGT6.4
SPI4_MOSI  (via drill 0.6)
  Route 0.203: v40.55,29.58 40.55,45.18 41.45,46.08 41.45,66.08 37.15,70.38 v37.15,71.28
  GND 0.203: LOCAL_MEM.10 38.92,24.85 40.55,26.48 v40.55,29.58 | STM32F7646BGT6.5 38,72.13 v37.15,71.28
SS0_LOC  (via drill 0.6)
  Top 0.203: U1.27 69.5,40.93 v68.85,41.58
  GND 0.203: CAMERA.1 55.71,48.92 62.64,41.98 67.84,41.98 68.25,41.58 v68.85,41.58
SS1LOC_MEM  (via drill 0.6)
  Top 0.203: U4.14 65.78,31.55 v65.95,31.72 | U1.29 72.6,41.93 73.05,41.48 73.05,41.08 74.05,40.08 v74.05,38.98
  Route 0.203: v65.95,31.72 71.71,37.48 72.55,37.48 v74.05,38.98
SS_ICU  (via drill 0.6)
  Top 0.203: R76.1 67.44,30.92 U4.13 60.91,30.92 v60.35,31.48
  Supply 0.203: v39.34,44.58 v39.35,44.57 39.35,41.48 47.15,33.68 58.15,33.68 v60.35,31.48
  GND 0.203: STM32F7646BGT6.53 38.8,45.03 39.25,44.58 v39.34,44.58
SWCLK
  GND 0.203: STM32F7646BGT6.159 14.3,76.8 15.98,78.48 21.15,78.48 22.77,80.1 ICU_PROG1.4
SWCLK_LOC  (via drill 0.6)
  Top 0.203: U1.45 66.4,42.83 v66.45,42.78
  Supply 0.203: v66.45,42.78 63.65,39.98 63.65,15.78 v70.1,9.33
  GND 0.203: LOC_PWR_PROG.6 70.03,9.25 v70.1,9.33
SWDIO
  GND 0.203: STM32F7646BGT6.147 13.3,69.63 13.56,69.89 13.56,73.87 12.91,74.52 12.91,76.9 15.08,79.08 20.65,79.08 21.52,79.95 ICU_PROG1.3
SWDIO_LOC  (via drill 0.6)
  Top 0.203: U1.46 65.9,43.43 v65.25,42.78
  Supply 0.203: v65.25,42.78 63.25,40.78 63.25,15.18 v71.25,7.18
  GND 0.203: LOC_PWR_PROG.5 71.25,5.7 v71.25,7.18
SWO
  GND 0.203: STM32F7646BGT6.192 30.69,76.16 30.69,76.9 30.02,77.57 27.25,77.57 25.27,79.55 ICU_PROG1.6
THERM_OUT_2
  Top 0.203: U1.9 62.31,41.43 61.7,42.03 51.61,42.03 U3.8 52.61,43.03 R1.1
TX1  (via drill 0.6)
  Top 0.203: v59.05,36.18 65.25,36.18 66.4,37.33 U1.16
  Route 0.203: v19.65,9.58 27.05,16.98 35.25,16.98 37.2,18.93 37.2,24.53 48.55,35.88 58.75,35.88 v59.05,36.18
  Supply 0.203: v59.05,36.18 46.25,36.18 40.65,41.78 40.65,44.58 39.75,45.48 36.75,45.48 27.7,54.53 27.7,55.83 v26.45,57.08
  GND 0.203: STM32F7646BGT6.143 13.8,67.63 24.35,57.08 v26.45,57.08 | PWR-UART_ICU.2 19.73,9.5 v19.65,9.58
TX2  (via drill 0.6)
  Top 0.203: v24.05,40.68 24.05,44.38 24.75,45.08 30.39,45.08 33.34,48.03 33.34,51.27 34.65,52.58 v38.45,52.58
  Supply 0.203: v15.95,9.58 17.95,11.58 17.95,30.38 17.94,30.39 17.94,33.57 19.56,35.19 19.56,36.18 v24.05,40.68
  GND 0.203: STM32F7646BGT6.45 38.9,52.13 v38.45,52.58 | PWR-UART_ICU.5 15.97,9.55 v15.95,9.58
TX_LED  (via drill 0.6)
  Top 0.203: U1.39 69.4,45.48 v69.45,45.48 | v73.65,34.58 LED2.C
  Supply 0.203: v73.65,34.58 70.25,37.98 70.25,44.68 v69.45,45.48
VBAT_H2-45  (via drill 0.6)
  Top 0.203: v30.75,13.38 v30.74,13.38 v12.05,13.38
  Supply 0.203: v70.35,14.58 74.45,18.68 85.8,18.68 U$1.P$97
  GND 0.203: P1.1 9.34,13.38 v12.05,13.38 | P2.8 36.52,9.48 35.25,9.48 34.94,9.79 34.94,11.8 33.35,13.38 v30.75,13.38 69.15,13.38 v70.35,14.58
VBAT_H2-46  (via drill 0.6)
  Supply 0.203: U$1.P$98 88.55,19.77 87.05,18.28 75.25,18.28 v71.55,14.58
  GND 0.203: P2.9 42.17,13.02 69.99,13.02 v71.55,14.58
VCC_P4  (via drill 0.6)
  Top 0.203: v37.95,84.78 v54.05,84.78
  GND 0.203: P4.3 36.67,83.5 v37.95,84.78 | P3.6 55.6,83.23 v54.05,84.78
VDD-ST  (via drill 0.6)
  Top 0.203: R76.2 61.1,22.68 v53.65,22.68
  Supply 1.016: ICU-PWR-SRC.8 ICU-PWR-SRC.6 ICU-PWR-SRC.4 ICU-PWR-SRC.2
  Supply 1.27: ICU-PWR-SRC.2 13.93,75.88
  GND 0.203: STM32F7646BGT6.94 18.3,50.03 v17.75,50.58 | v36.81,74.18 v36.8,74.19 STM32F7646BGT6.204 | STM32F7646BGT6.158 13.8,74.63 v13.85,74.58 | v13.75,49.58 13.8,49.53 STM32F7646BGT6.103 | STM32F7646BGT6.115 13.2,53.63 v13.65,53.18 | STM32F7646BGT6.185 27.3,74.23 v27.25,74.18 | STM32F7646BGT6.52 39.2,48.63 v39.15,48.58 | STM32F7646BGT6.59 35.8,48.93 v35.85,48.98 | STM32F7646BGT6.6 39.2,71.63 v38.75,71.18 | STM32F7646BGT6.26 39.3,61.63 v38.85,61.19 | v37.95,53.78 38.1,53.63 STM32F7646BGT6.42 | STM32F7646BGT6.39 38.8,55.13 v38.75,55.17 | STM32F7646BGT6.137 12.8,64.63 v12.95,64.48 | v24.05,53.29 25.63,53.29 28.8,50.12 STM32F7646BGT6.73 | STM32F7646BGT6.124 12.9,58.13 v12.95,58.08 | U5.49 16.25,33.08 v15.85,32.68 | U5.43 16.15,28.28 v15.85,28.58 | QSPI_MEM.2 46.18,37.98 v39.05,37.98 | v49.45,25.08 48.41,26.12 LOCAL_MEM.1 LOCAL_MEM.2 | R77.2 R78.2 47.02,15.53 v46.65,15.16 | LOCAL_MEM.16 37.05,17.18 v39.15,17.18 | U5.27 28.55,16.26 v28.55,14.98 | R79.2 48.75,31.08 v46.95,29.28 | R33.2 R17.2 41.2,80.93 52.05,70.08 52.05,31.28 v49.45,28.68 | U5.1 29.24,37.08 29.64,36.67 29.64,36.04 29.08,35.48 U5.3
  GND 0.254: STM32F7646BGT6.150 12.2,71.13 v12.85,71.78 | v20.25,74.18 20.3,74.23 STM32F7646BGT6.171 | STM32F7646BGT6.15 40.65,67.21 39.88,67.21 39.51,67.58 v36.75,67.58 | STM32F7646BGT6.41 STM32F7646BGT6.42 | STM32F7646BGT6.83 23.8,47.83 v23.15,48.48 | U5.1 28.57,38 v28.65,38.08 | U5.14 30.05,26.68 v30.45,27.08 | U5.9 29.35,30.68 v30.2,31.53
  pour Supply: 10.35,74.98 12.45,77.08 41.85,77.08 41.85,41.58 14.75,41.58 10.55,45.78 10.55,74.78
  pour Supply: 10.55,44.08 10.55,10.28 12.75,8.08 42.75,8.08 56.65,21.98 56.45,21.98 50.75,27.68 50.75,40.38 46.15,44.98 11.45,44.98
XTAL4
  GND 0.203: STM32F7646BGT6.33 43.9,58.13 47.15,54.88 ICU_XTAL1.1 C11.2

## Text on the board
bNames: LOCANA X ICU
bTest: VBAT | 5V | SCL | 3.3V | SDA | CAN_HIGH | 5V | GND | 3.3v | SDA | GND | CAN_HIGH | CAN_LOW | GND | SDL | CAN_LOW | 5V
Name: LOCANA + ICU BOARD